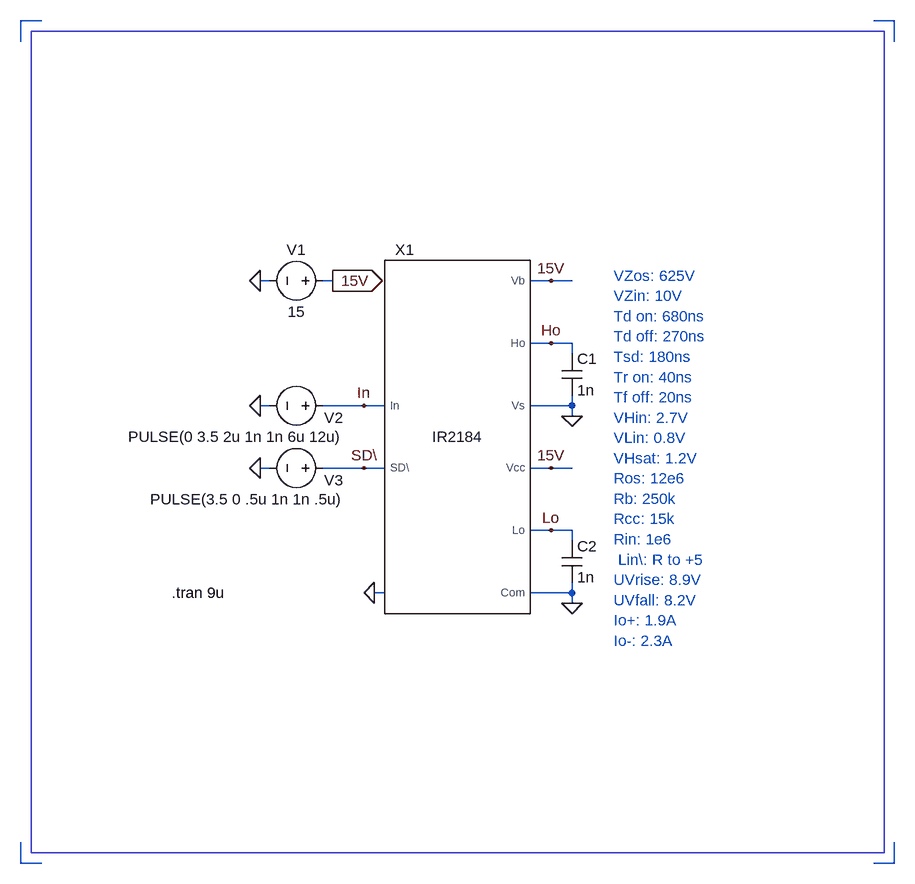
[diagram p0: schematic IR2184_test.asc]
IR2184_test.asc, the LTspice schematic file:
Version 4
SHEET 1 13828 1048
WIRE 736 -768 736 -800
WIRE 736 496 736 464
WIRE 768 -800 736 -800
WIRE 768 496 736 496
WIRE 1120 -400 1104 -400
WIRE 1120 -208 1104 -208
WIRE 1120 -112 1104 -112
WIRE 1216 -400 1200 -400
WIRE 1264 -208 1200 -208
WIRE 1264 -112 1200 -112
WIRE 1296 -208 1264 -208
WIRE 1296 -112 1264 -112
WIRE 1296 80 1280 80
WIRE 1552 -400 1520 -400
WIRE 1552 -304 1520 -304
WIRE 1552 -112 1520 -112
WIRE 1552 -16 1520 -16
WIRE 1584 -400 1552 -400
WIRE 1584 -304 1552 -304
WIRE 1584 -288 1584 -304
WIRE 1584 -208 1520 -208
WIRE 1584 -208 1584 -224
WIRE 1584 -192 1584 -208
WIRE 1584 -112 1552 -112
WIRE 1584 -16 1552 -16
WIRE 1584 0 1584 -16
WIRE 1584 80 1520 80
WIRE 1584 80 1584 64
WIRE 1584 96 1584 80
WIRE 2080 -800 2048 -800
WIRE 2080 -768 2080 -800
WIRE 2080 496 2048 496
WIRE 2080 496 2080 464
FLAG 1104 -112 0
FLAG 1264 -112 SD\
FLAG 1584 -192 0
FLAG 1552 -304 Ho
FLAG 1584 96 0
FLAG 1552 -16 Lo
FLAG 1104 -208 0
FLAG 1264 -208 In
FLAG 1280 80 0
FLAG 1552 -400 15V
FLAG 1552 -112 15V
FLAG 1216 -400 15V
IOPIN 1216 -400 Out
FLAG 1104 -400 0
SYMBOL voltage 1216 -208 R90
WINDOW 0 19 -16 VRight 0
WINDOW 3 48 -16 VRight 0
SYMATTR InstName V2
SYMATTR Value PULSE(0 3.5 2u 1n 1n 6u 12u)
SYMBOL voltage 1216 -112 R90
WINDOW 0 19 -16 VRight 0
WINDOW 3 48 -16 VRight 0
SYMATTR InstName V3
SYMATTR Value PULSE(3.5 0 .5u 1n 1n .5u)
SYMBOL cap 1568 -288 R0
SYMATTR InstName C1
SYMATTR Value 1n
SYMBOL cap 1568 0 R0
SYMATTR InstName C2
SYMATTR Value 1n
SYMBOL voltage 1216 -400 R90
WINDOW 0 -32 56 VBottom 0
WINDOW 3 32 56 VTop 0
SYMATTR InstName V1
SYMATTR Value 15
SYMBOL IR2184 1408 -160 R0
SYMATTR InstName X1
TEXT 1648 -408 Left 0 ;VZos: 625V\nVZin: 10V\nTd on: 680ns\nTd off: 270ns\nTsd: 180ns\nTr on: 40ns\nTf off: 20ns\nVHin: 2.7V\nVLin: 0.8V\nVHsat: 1.2V\nRos: 12e6\nRb: 250k\nRcc: 15k\nRin: 1e6\n Lin\\: R to +5\nUVrise: 8.9V\nUVfall: 8.2V\nIo+: 1.9A\nIo-: 2.3A
TEXT 968 80 Left 0 !.tran 9u
RECTANGLE Normal 2064 480 752 -784

The netlist it stands for:
* IR2184_test.asc
V2 In 0 PULSE(0 3.5 2u 1n 1n 6u 12u)
V3 SD\ 0 PULSE(3.5 0 .5u 1n 1n .5u)
C1 Ho 0 1n
C2 Lo 0 1n
V1 15V 0 15
XX1 In SD\ 0 Lo 15V 0 Ho 15V IR2184 params: IR2184  ; pins In SD\ Com Lo Vcc Vs Ho Vb
* VZos: 625V
* VZin: 10V
* Td on: 680ns
* Td off: 270ns
* Tsd: 180ns
* Tr on: 40ns
* Tf off: 20ns
* VHin: 2.7V
* VLin: 0.8V
* VHsat: 1.2V
* Ros: 12e6
* Rb: 250k
* Rcc: 15k
* Rin: 1e6
*  Lin\: R to +5
* UVrise: 8.9V
* UVfall: 8.2V
* Io+: 1.9A
* Io-: 2.3A
.tran 9u
.backanno
.end